# Altium schematic sheet foot-switch_board_01.SchDoc
size A; SheetNumber: 1; SheetTotal: 1
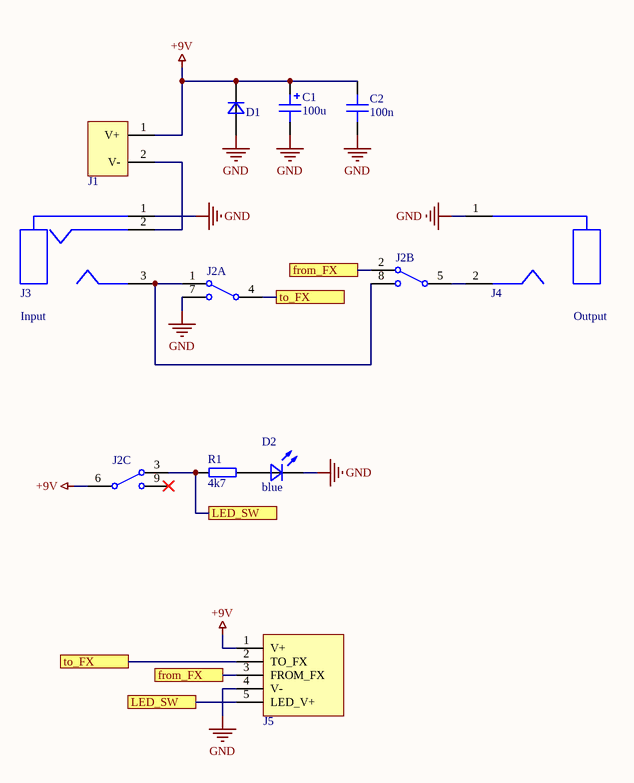
[diagram p0: foot-switch_board_01.SchDoc]

## Parts
C1  value 100u  [pol_cap_2x5x11_0.5_rad_flat]  (hidden comment: pol_cap_tht_2x5x11_flat)
C2  value 100n  [CAP_5mm]  (hidden comment: cap_tht_5mm)
D1  diode_tht_1n4007  [diode_tht]  (value not drawn)
D2  value blue  [led_3mm]  (hidden comment: led_blue_tht_3mm)
J1  2 Pole 2.54mm  [2.54mm_2pole]  (value not drawn)  (no BOM)
J2  SF17010F-0302-21R-L  [SF17010F-0302-21R-L]  (value not drawn)  (parts A,B,C of 3)
J3  Audio Jack 6mm 3 pole contacts  [2.54mm_3pole]  (value not drawn)  (no BOM)
J4  Audio Jack 6mm 2 pole contacts  [2.54mm_2pole]  (value not drawn)  (no BOM)
J5  5 Pole Ribbon Connector  [1.27mm_5pole_edge]  (value not drawn)  (no BOM)
R1  value 4k7  [res_P10mm_axial]  (hidden comment: res_mcmf_series_tht_axial_P10mm)

## Ports
from_FX (see foot-switch_board_01[2C]), from_FX (see foot-switch_board_01[3B]), LED_SW (see foot-switch_board_01[2C]), LED_SW (see foot-switch_board_01[2D]), to_FX (see foot-switch_board_01[2C]), to_FX (see foot-switch_board_01[3B])

## Nets
+9V: C1.1 C2.2 D1.2 J1.1(V+) J2.6 J5.1(V+)
GND: C1.2 C2.1 D1.1 D2.2(kathode) J2.7 J3.1 J4.1 J5.4(V-)
from_FX: J2.2 J5.3(FROM_FX) ; port from_FX
LED_SW: J2.3 J5.5(LED_V+) R1.1 ; port LED_SW
to_FX: J2.4 J5.2(TO_FX) ; port to_FX
NetD2_1: D2.1(anode) R1.2
NetJ1_2: J1.2(V-) J3.2
NetJ2_1: J2.1 J2.8 J3.3
NetJ2_5: J2.5 J4.2

Not connected (* = marked no-connect by the designer): J2 9*

## Notes on the sheet
- Input
- Output

## Library data of the parts
C1 = pol_cap_tht_2x5x11_flat: Kondensatoranschlüsse: Radial bedrahtet / Anschlussabstand: 2mm / Produktdurchmesser: 5mm / Produkthöhe: 11mm / Anschlussdurchmesser: 0.5mm; Manufacturer: *; Supplier: Farnell; Manufacturer Part Number: *; Supplier Part Number: *; Price: *; ComponentLink1Description: Manufacturer Link; ComponentLink1URL: *; ComponentLink2Description: Supplier Link; ComponentLink2URL: https://at.farnell.com/w/c/passive-bauelemente/kondensatoren/aluminium-elektrolytkondensatoren/bedrahtete-aluminium-elektrolytkondensatoren?kapazitat=1uf|2.2uf|10uf|22uf|100uf&spannung-dc-=10v|16v|25v|35v|50v|63v|100v&kondensatoranschlusse=radial-bedrahtet&anschlussabstand=2mm&produktdurchmesser=5mm&produkthohe=11mm&anschlussdurchmesser=0.5mm&range=inc-in-stock|exc-delivery-surcharge|exc-obs; ComponentLink3Description: Datasheet Link; ComponentLink3URL: *
C2 = cap_tht_5mm: ceramic cap / Anschlussabstand: 5mm / 0.5mm lead diameter; Supplier: Farnell; Menufacturer: *; Manufacturer Part Numer: *; Supplier Part Number: *; Price: *; ComponentLink1Description: Manufacturer Link; ComponentLink1URL: *; ComponentLink2Description: Supplier Link; ComponentLink2URL: https://at.farnell.com/w/c/passive-bauelemente/kondensatoren/keramikkondensatoren/keramik-vielschichtkondensatoren-mlcc-bedrahtet?anschlussabstand=5mm&range=inc-in-stock|exc-delivery-surcharge|exc-obs; ComponentLink3Description: Datasheet Link; ComponentLink3URL: *
D1 = diode_tht_1n4007: Manufacturer: onsemi; Manufacturer Part Number: 1N4007RLG; Supplier: Farnell; Supplier Part Number: 2317417; Price: 0.321; ComponentLink1Description: Manufacturer Link; ComponentLink1URL: *; ComponentLink2Description: Supplier Link; ComponentLink2URL: https://at.farnell.com/on-semiconductor/1n4007rlg/diode-std-erholzeit-1a-1kv-axial/dp/2317417; ComponentLink3Description: Datasheet Link; ComponentLink3URL: https://4donline.ihs.com/images/VipMasterIC/IC/ONSM/ONSM-S-A0013576855/ONSM-S-A0013902349-1.pdf?hkey=6D3A4C79FDBF58556ACFDE234799DDF0
D2 = led_blue_tht_3mm: Durchlassstrom If: 20mA / Durchlassspannung: 3.7V; Manufacturer: Forge; Manufacturer Part Number: FNL-U300B22CDSL; Supplier: Farnell; Supplier Part Number: 1200580; Price: 0.784; ComponentLink1Description: Supplier Link; ComponentLink1URL: https://at.farnell.com/forge/fnl-u300b22cdsl/led-3mm-blau/dp/1200580; ComponentLink2Description: Datasheet Link; ComponentLink2URL: https://www.farnell.com/datasheets/1508743.pdf
J1 = 2 Pole 2.54mm: Solder contacts for a 2.54mm connector
J2 = Alpha 3PDT Footswitch PCB: Alpha Footswitch 3PDT, PCB; Manufacturer: Alpha; Supplier: Tube Town; ComponentLink1Description: Supplier Link; ComponentLink1URL: https://www.tube-town.net/ttstore/alpha-fussschalter-3-pol-wechsler-pcb.html; ComponentLink2Description: Manufacturer Link; ComponentLink2URL: http://www.taiwanalpha.com/en/products/8?cat=61#alpha_display; ComponentLink3Description: Datasheet Link; ComponentLink3URL: http://www.taiwanalpha.com/downloads?target=products&id=242; Price: 3.98; Manufacturer Part Number: SF17010F-0302-21R-L; Supplier Part Number: xsw24
J3 = Audio Jack 6mm 3 pole contacts: Solder contacts for a 6mm stereo audio jack
J4 = Audio Jack 6mm 2 pole contacts: Solder contacts for a 6mm mono audio jack
J5 = 5 Pole Ribbon Connector: Solder contacts for a 1.27mm ribbon cable
R1 = res_mcmf_series_tht_axial_P10mm: metal oxide / Produktpalette: MCMF / Produktdurchmesser: 2.5mm / Produktlänge: 6.8mm; Manufacturer: Multicomp Pro; Manufacturer Part Number: MCMF006FF1002A50; ComponentLink1Description: Supplier Link; ComponentLink1URL: https://at.farnell.com/w/c/passive-bauelemente/festwiderstande/widerstande-fur-durchsteckmontage?brand=multicomp-pro&produktpalette=mcmf&widerstandstechnologie=metallschichtwiderstand&produktlange=6.8mm&range=inc-in-stock|exc-delivery-surcharge|exc-obs; ComponentLink2Description: Datasheet Link; ComponentLink2URL: https://www.farnell.com/datasheets/2863892.pdf; Supplier: Farnell; Supplier Part Number: 2401780